# Altium schematic sheet Main.SchDoc
size A2
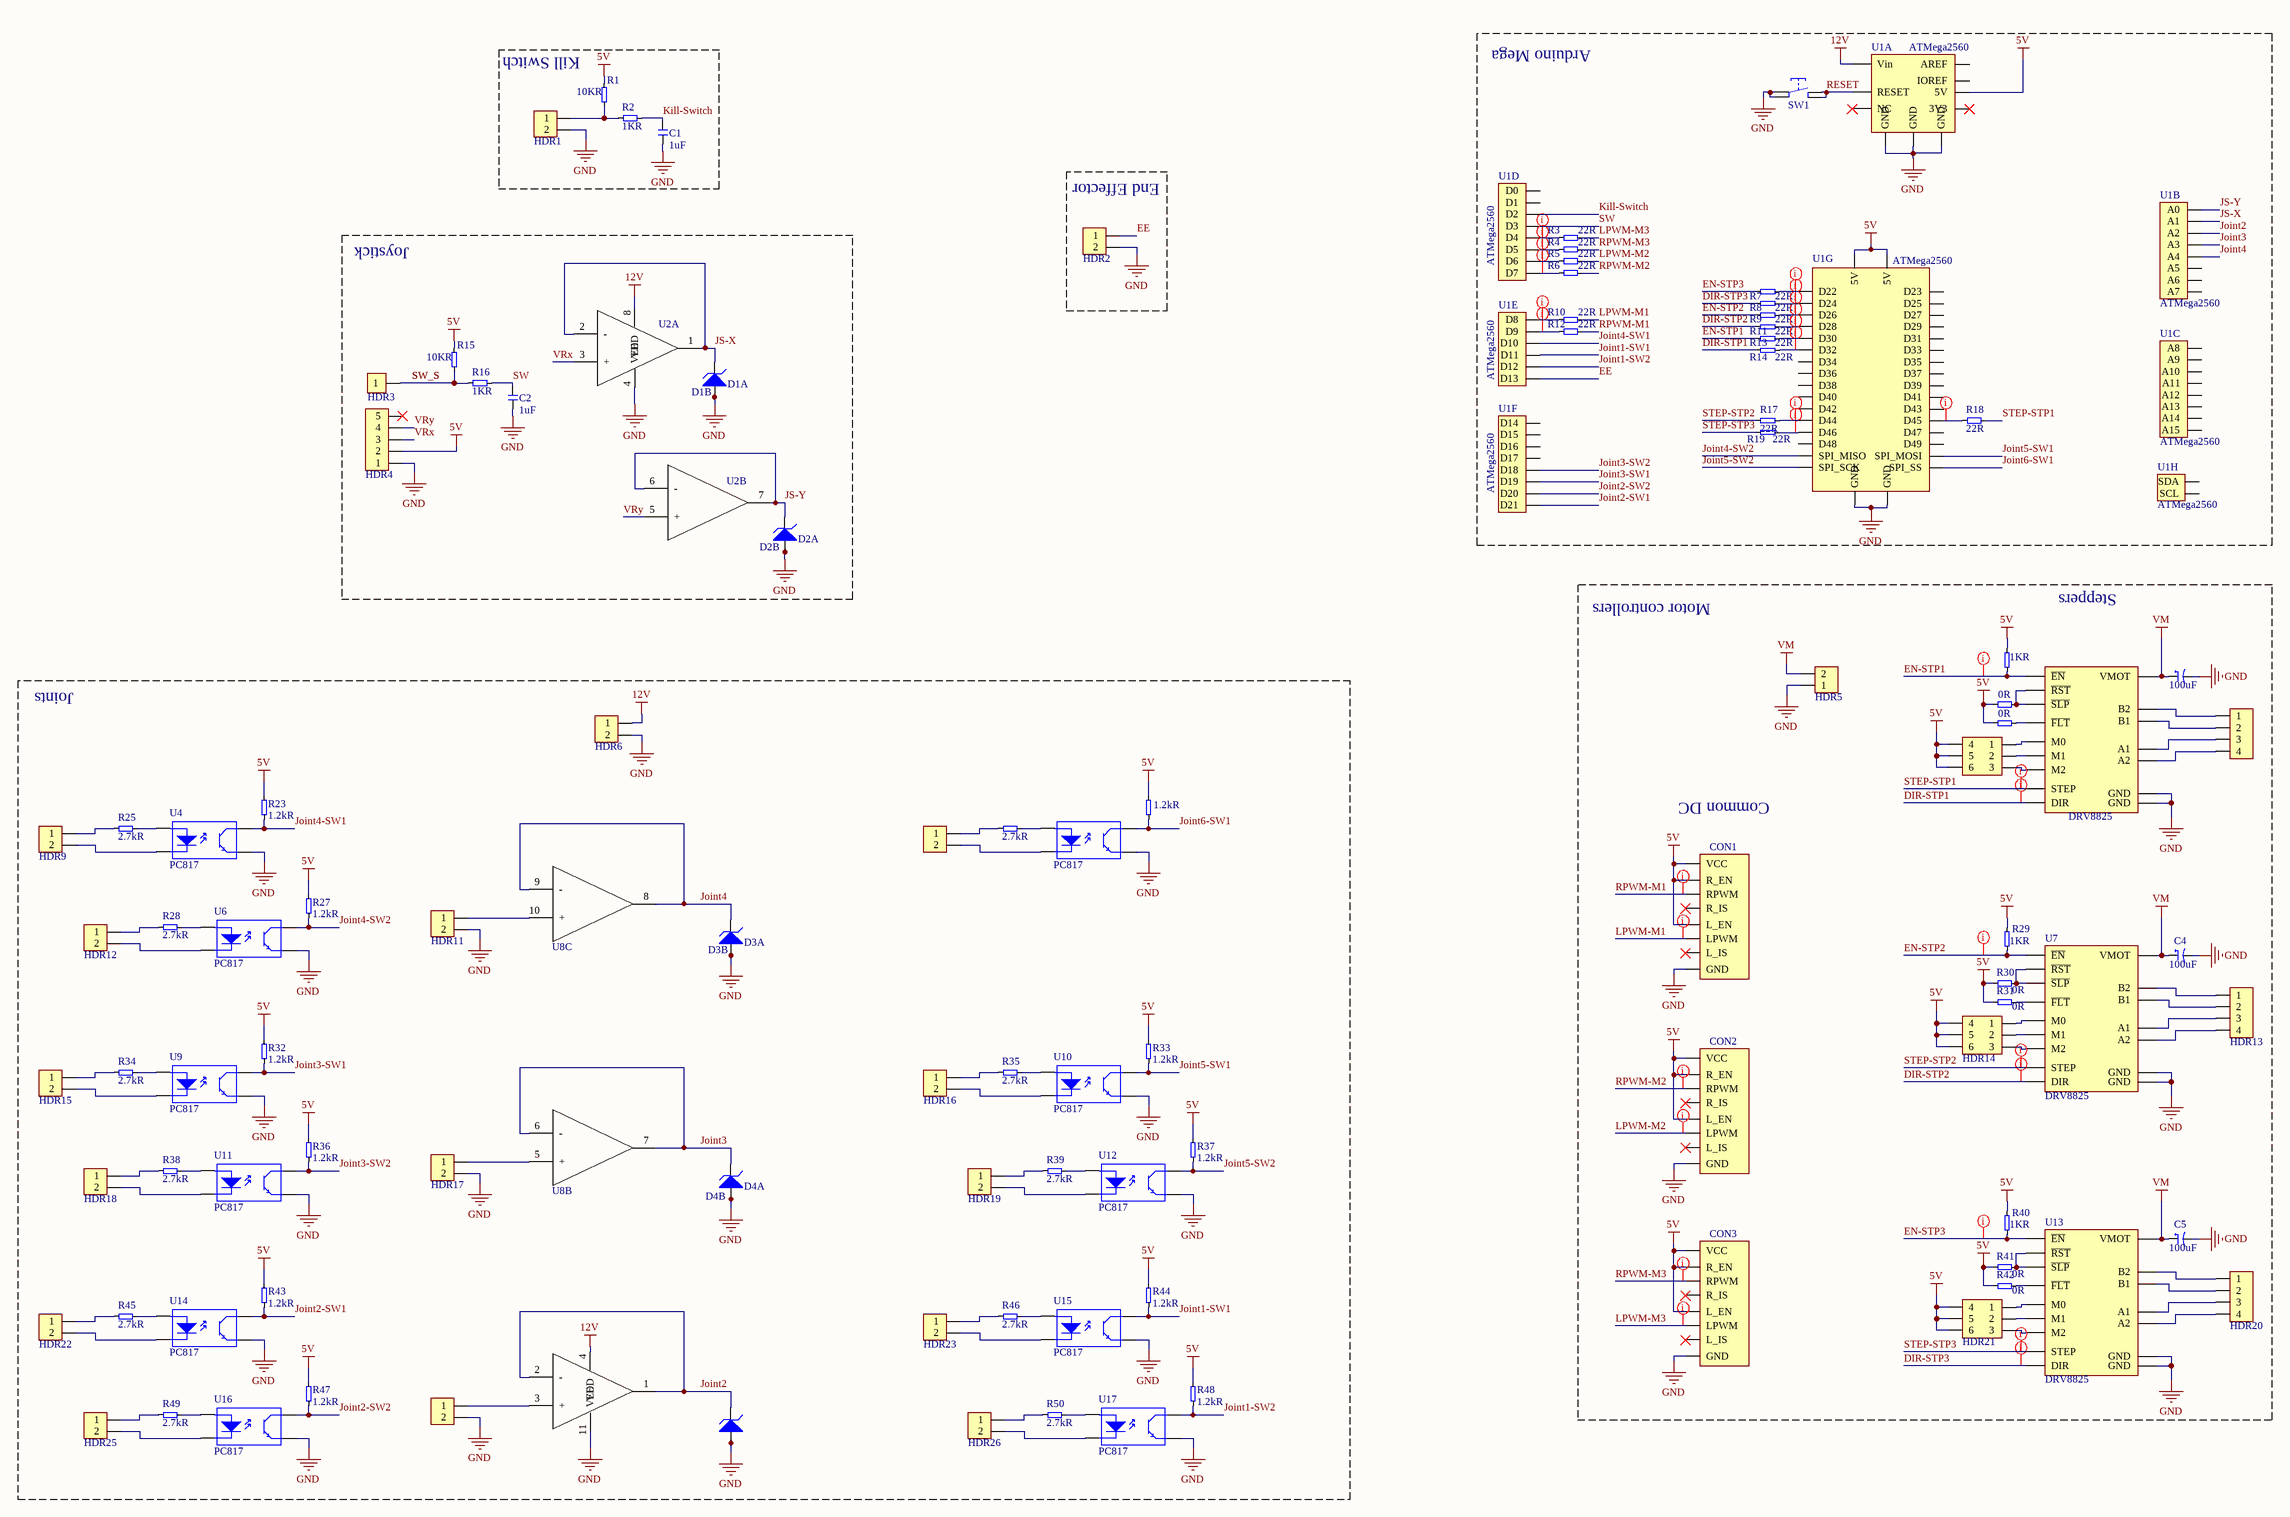
[diagram p0: Main.SchDoc]

## Parts
C1  1uF  [0603]
C2  1uF  [0603]
C3  100uF  [C-AL-SMD-C]
C4  100uF  [C-AL-SMD-C]
C5  100uF  [C-AL-SMD-C]
CON1  BTS7960-Coonector  [HEADER-2x4]  (value not drawn)
CON2  BTS7960-Coonector  [HEADER-2x4]  (value not drawn)
CON3  BTS7960-Coonector  [HEADER-2x4]  (value not drawn)
D1  D. Zener - SOT23-3 2NC  [SOT-23-3]  (value not drawn)  (parts A,B of 2)
D2  D. Zener - SOT23-3 2NC  [SOT-23-3]  (value not drawn)  (parts A,B of 2)
D3  D. Zener - SOT23-3 2NC  [SOT-23-3]  (value not drawn)  (parts A,B of 2)
D4  D. Zener - SOT23-3 2NC  [SOT-23-3]  (value not drawn)  (parts A,B of 2)
D5  D. Zener - SOT23-3 2NC  [SOT-23-3]  (value not drawn)  (parts A,B of 2)
HDR1  Header 1x2  [HEADER-1X2-KK]  (value not drawn)
HDR2  Header 1x2  [HEADER-1X2-KK]  (value not drawn)
HDR3  Header 1x1  [HEADER-1x1]  (value not drawn)
HDR4  Header 1x5  [HEADER-1X5]  (value not drawn)
HDR5  Header 1x2  [HEADER-1X2-BORNE-25-E1000]  (value not drawn)
HDR6  Header 1x2  [HEADER-1X2-KK]  (value not drawn)
HDR7  Header 1x4  [Header-1x4-KK]  (value not drawn)
HDR8  Header 2x3  [Header-2x3-Male]  (value not drawn)
HDR9  Header 1x2  [HEADER-1X2-KK]  (value not drawn)
HDR10  Header 1x2  [HEADER-1X2-KK]  (value not drawn)
HDR11  Header 1x2  [HEADER-1X2-KK]  (value not drawn)
HDR12  Header 1x2  [HEADER-1X2-KK]  (value not drawn)
HDR13  Header 1x4  [Header-1x4-KK]  (value not drawn)
HDR14  Header 2x3  [Header-2x3-Male]  (value not drawn)
HDR15  Header 1x2  [HEADER-1X2-KK]  (value not drawn)
HDR16  Header 1x2  [HEADER-1X2-KK]  (value not drawn)
HDR17  Header 1x2  [HEADER-1X2-KK]  (value not drawn)
HDR18  Header 1x2  [HEADER-1X2-KK]  (value not drawn)
HDR19  Header 1x2  [HEADER-1X2-KK]  (value not drawn)
HDR20  Header 1x4  [Header-1x4-KK]  (value not drawn)
HDR21  Header 2x3  [Header-2x3-Male]  (value not drawn)
HDR22  Header 1x2  [HEADER-1X2-KK]  (value not drawn)
HDR23  Header 1x2  [HEADER-1X2-KK]  (value not drawn)
HDR24  Header 1x2  [HEADER-1X2-KK]  (value not drawn)
HDR25  Header 1x2  [HEADER-1X2-KK]  (value not drawn)
HDR26  Header 1x2  [HEADER-1X2-KK]  (value not drawn)
R1  10KR  [0603]
R2  1KR  [0603]
R3  22R  [0603]
R4  22R  [0603]
R5  22R  [0603]
R6  22R  [0603]
R7  22R  [0603]
R8  22R  [0603]
R9  22R  [0603]
R10  22R  [0603]
R11  22R  [0603]
R12  22R  [0603]
R13  22R  [0603]
R14  22R  [0603]
R15  10KR  [0603]
R16  1KR  [0603]
R17  22R  [0603]
R18  22R  [0603]
R19  22R  [0603]
R20  1KR  [0603]
R21  0R  [0603]
R22  0R  [0603]
R23  1.2kR  [0603]
R24  1.2kR  [0603]
R25  2.7kR  [0603]
R26  2.7kR  [0603]
R27  1.2kR  [0603]
R28  2.7kR  [0603]
R29  1KR  [0603]
R30  0R  [0603]
R31  0R  [0603]
R32  1.2kR  [0603]
R33  1.2kR  [0603]
R34  2.7kR  [0603]
R35  2.7kR  [0603]
R36  1.2kR  [0603]
R37  1.2kR  [0603]
R38  2.7kR  [0603]
R39  2.7kR  [0603]
R40  1KR  [0603]
R41  0R  [0603]
R42  0R  [0603]
R43  1.2kR  [0603]
R44  1.2kR  [0603]
R45  2.7kR  [0603]
R46  2.7kR  [0603]
R47  1.2kR  [0603]
R48  1.2kR  [0603]
R49  2.7kR  [0603]
R50  2.7kR  [0603]
SW1  Button  [TL 3342]  (value not drawn)
U1  ATMega2560  [Arduino-Mega2560]  (parts A,B,C,D,E,F,G,H of 8)
U2  AmpOp-2u  [SOIC-8]  (value not drawn)  (parts A,B of 2)
U3  DRV8825  [DRV8825]
U4  PC817  [SOP-04]
U5  PC817  [SOP-04]
U6  PC817  [SOP-04]
U7  DRV8825  [DRV8825]
U8  AmpOp-4u  [SOIC-14]  (value not drawn)  (parts A,B,C of 4)
U9  PC817  [SOP-04]
U10  PC817  [SOP-04]
U11  PC817  [SOP-04]
U12  PC817  [SOP-04]
U13  DRV8825  [DRV8825]
U14  PC817  [SOP-04]
U15  PC817  [SOP-04]
U16  PC817  [SOP-04]
U17  PC817  [SOP-04]

## Blocks framed on the sheet
Arduino Mega: R3-R14 R17-R19 SW1 U1
Kill Switch: C1 HDR1 R1 R2
End Effector: HDR2
Joystick: C2 D1 D2 HDR3 HDR4 R15 R16 U2
Joints: D3-D5 HDR6 HDR9-HDR12 HDR15-HDR19 HDR22-HDR26 R23-R28 R32-R39 R43-R50 U4-U6 U8-U12 U14-U17

## Nets
5V: CON1.3(R_EN) CON1.4(L_EN) CON1.7(VCC) CON2.3(R_EN) CON2.4(L_EN) CON2.7(VCC) CON3.3(R_EN) CON3.4(L_EN) CON3.7(VCC) HDR4.2 HDR8.4 HDR8.5 HDR8.6 HDR14.4 HDR14.5 HDR14.6 HDR21.4 HDR21.5 HDR21.6 R1.2 R15.2 R20.2 R21.2 R22.2 R23.2 R24.2 R27.2 R29.2 R30.2 R31.2 R32.2 R33.2 R36.2 R37.2 R40.2 R41.2 R42.2 R43.2 R44.2 R47.2 R48.2 U1.5(5V) U1.59(5V) U1.60(5V)
12V: HDR6.1 U1.8(Vin) U2.8(VDD) U8.4(VDD)
GND: C1.2 C2.2 C3.2 C4.2 C5.2 CON1.8(GND) CON2.8(GND) CON3.8(GND) D1.1 D1.2 D2.1 D2.2 D3.1 D3.2 D4.1 D4.2 D5.1 D5.2 HDR1.2 HDR2.2 HDR4.1 HDR5.1 HDR6.2 HDR11.2 HDR17.2 HDR24.2 SW1.3 SW1.4 U1.6(GND) U1.7(GND) U1.25(GND) U1.26(GND) U1.83(GND) U2.4(VEE) U3.10(GND) U3.16(GND) U4.3 U5.3 U6.3 U7.10(GND) U7.16(GND) U8.11(VEE) U9.3 U10.3 U11.3 U12.3 U13.10(GND) U13.16(GND) U14.3 U15.3 U16.3 U17.3
VM: C3.1 C4.1 C5.1 HDR5.2 U3.9(VMOT) U7.9(VMOT) U13.9(VMOT)
DIR-STP1: R14.2 U3.8(DIR)
DIR-STP2: R11.2 U7.8(DIR)
DIR-STP3: R8.2 U13.8(DIR)
EE: HDR2.1 U1.82(D13)
EN-STP1: R13.2 R20.1 U3.1(~{EN})
EN-STP2: R9.2 R29.1 U7.1(~{EN})
EN-STP3: R7.2 R40.1 U13.1(~{EN})
Joint1-SW1: R44.1 U1.80(D11) U15.4
Joint1-SW2: R48.1 U1.81(D12) U17.4
Joint2: D5.3 U1.11(A2) U8.1(NC) U8.2(-)
Joint2-SW1: R43.1 U1.61(D21) U14.4
Joint2-SW2: R47.1 U1.62(D20) U16.4
Joint3: D4.3 U1.12(A3) U8.6(-) U8.7(VDD)
Joint3-SW1: R32.1 U1.63(D19) U9.4
Joint3-SW2: R36.1 U1.64(D18) U11.4
Joint4: D3.3 U1.13(A4) U8.8(VDD) U8.9(-)
Joint4-SW1: R23.1 U1.79(D10) U4.4
Joint4-SW2: R27.1 U1.30(SPI_MISO) U6.4
Joint5-SW1: R33.1 U1.29(SPI_MOSI) U10.4
Joint5-SW2: R37.1 U1.28(SPI_SCK) U12.4
Joint6-SW1: R24.1 U1.27(SPI_SS) U5.4
JS-X: D1.3 U1.10(A1) U2.1(NC) U2.2(-)
JS-Y: D2.3 U1.9(A0) U2.6(-) U2.7(VDD)
Kill-Switch: C1.1 R2.2 U1.71(D2)
LPWM-M1: CON1.2(LPWM) R10.2
LPWM-M2: CON2.2(LPWM) R5.2
LPWM-M3: CON3.2(LPWM) R3.2
RESET: SW1.1 SW1.2 U1.3(RESET)
RPWM-M1: CON1.1(RPWM) R12.2
RPWM-M2: CON2.1(RPWM) R6.2
RPWM-M3: CON3.1(RPWM) R4.2
STEP-STP1: R18.2 U3.7(STEP)
STEP-STP2: R17.2 U7.7(STEP)
STEP-STP3: R19.2 U13.7(STEP)
SW: C2.1 R16.2 U1.72(D3)
SW_S: HDR3.1 R15.1 R16.1
VRx: HDR4.3 U2.3(+)
VRy: HDR4.4 U2.5(+)
NetHDR1_1: HDR1.1 R1.1 R2.1
NetHDR7_1: HDR7.1 U3.11(B2)
NetHDR7_2: HDR7.2 U3.12(B1)
NetHDR7_3: HDR7.3 U3.13(A1)
NetHDR7_4: HDR7.4 U3.14(A2)
NetHDR8_1: HDR8.1 U3.2(M0)
NetHDR8_2: HDR8.2 U3.3(M1)
NetHDR8_3: HDR8.3 U3.4(M2)
NetHDR9_1: HDR9.1 R25.1
NetHDR9_2: HDR9.2 U4.2
NetHDR10_1: HDR10.1 R26.1
NetHDR10_2: HDR10.2 U5.2
NetHDR11_1: HDR11.1 U8.10(+)
NetHDR12_1: HDR12.1 R28.1
NetHDR12_2: HDR12.2 U6.2
NetHDR13_1: HDR13.1 U7.11(B2)
NetHDR13_2: HDR13.2 U7.12(B1)
NetHDR13_3: HDR13.3 U7.13(A1)
NetHDR13_4: HDR13.4 U7.14(A2)
NetHDR14_1: HDR14.1 U7.2(M0)
NetHDR14_2: HDR14.2 U7.3(M1)
NetHDR14_3: HDR14.3 U7.4(M2)
NetHDR15_1: HDR15.1 R34.1
NetHDR15_2: HDR15.2 U9.2
NetHDR16_1: HDR16.1 R35.1
NetHDR16_2: HDR16.2 U10.2
NetHDR17_1: HDR17.1 U8.5(+)
NetHDR18_1: HDR18.1 R38.1
NetHDR18_2: HDR18.2 U11.2
NetHDR19_1: HDR19.1 R39.1
NetHDR19_2: HDR19.2 U12.2
NetHDR20_1: HDR20.1 U13.11(B2)
NetHDR20_2: HDR20.2 U13.12(B1)
NetHDR20_3: HDR20.3 U13.13(A1)
NetHDR20_4: HDR20.4 U13.14(A2)
NetHDR21_1: HDR21.1 U13.2(M0)
NetHDR21_2: HDR21.2 U13.3(M1)
NetHDR21_3: HDR21.3 U13.4(M2)
NetHDR22_1: HDR22.1 R45.1
NetHDR22_2: HDR22.2 U14.2
NetHDR23_1: HDR23.1 R46.1
NetHDR23_2: HDR23.2 U15.2
NetHDR24_1: HDR24.1 U8.3(+)
NetHDR25_1: HDR25.1 R49.1
NetHDR25_2: HDR25.2 U16.2
NetHDR26_1: HDR26.1 R50.1
NetHDR26_2: HDR26.2 U17.2
NetR3_1: R3.1 U1.73(D4)
NetR4_1: R4.1 U1.74(D5)
NetR5_1: R5.1 U1.75(D6)
NetR6_1: R6.1 U1.76(D7)
NetR7_1: R7.1 U1.58(D22)
NetR8_1: R8.1 U1.56(D24)
NetR9_1: R9.1 U1.54(D26)
NetR10_1: R10.1 U1.77(D8)
NetR11_1: R11.1 U1.52(D28)
NetR12_1: R12.1 U1.78(D9)
NetR13_1: R13.1 U1.50(D30)
NetR14_1: R14.1 U1.48(D32)
NetR17_1: R17.1 U1.36(D44)
NetR18_1: R18.1 U1.35(D45)
NetR19_1: R19.1 U1.34(D46)
NetR21_1: R21.1 U3.5(~{RST}) U3.6(~{SLP})
NetR22_1: R22.1 U3.15(~{FLT})
NetR25_2: R25.2 U4.1
NetR26_2: R26.2 U5.1
NetR28_2: R28.2 U6.1
NetR30_1: R30.1 U7.5(~{RST}) U7.6(~{SLP})
NetR31_1: R31.1 U7.15(~{FLT})
NetR34_2: R34.2 U9.1
NetR35_2: R35.2 U10.1
NetR38_2: R38.2 U11.1
NetR39_2: R39.2 U12.1
NetR41_1: R41.1 U13.5(~{RST}) U13.6(~{SLP})
NetR42_1: R42.1 U13.15(~{FLT})
NetR45_2: R45.2 U14.1
NetR46_2: R46.2 U15.1
NetR49_2: R49.2 U16.1
NetR50_2: R50.2 U17.1

Not connected (* = marked no-connect by the designer): CON1 5(R_IS)* 6(L_IS)*; CON2 5(R_IS)* 6(L_IS)*; CON3 5(R_IS)* 6(L_IS)*; HDR4 5*; U1 1(NC)* 2(IOREF) 4(3V3)* 14(A5) 15(A6) 16(A7) 17(A8) 18(A9) 19(A10) 20(A11) 21(A12) 22(A13) 23(A14) 24(A15) 31(D49) 32(D48) 33(D47) 37(D43) 38(D42) 39(D41) 40(D40) 41(D39) 42(D38) 43(D37) 44(D36) 45(D35) 46(D34) 47(D33) 49(D31) 51(D29) 53(D27) 55(D25) 57(D23) 65(D17) 66(D16) 67(D15) 68(D14) 69(D0) 70(D1) 84(AREF) 85(SDA) 86(SCL)

## Layout directives
rule Impedance Constraint [Min = 40.00    Max = 50.00    ]: DIR-STP1, DIR-STP2, DIR-STP3, EN-STP1, EN-STP2, EN-STP3, LPWM-M1, LPWM-M2, LPWM-M3, RPWM-M1, RPWM-M2, RPWM-M3, STEP-STP1, STEP-STP2, STEP-STP3
rule Impedance Constraint [Min = 0.000    Max = 2.000    ]: NetR3_1, NetR4_1, NetR5_1, NetR6_1, NetR7_1, NetR8_1, NetR9_1, NetR10_1, NetR11_1, NetR12_1, NetR13_1, NetR14_1, NetR17_1, NetR18_1, NetR19_1

## Notes on the sheet
- Motor controllers
- Steppers
- (near CON1) Common DC
- Title
- Size:
- Date:
- File:
- A2
- Number:
- Time:
- Revision:
- Sheet
- of

## Library data of the parts
C1 C2 = Capacitor-1: Capacitor; Rating: xV; Tolerance: x%; Value: 1uF
C3-C5 = Capacitor-2: Capacitor; Rating: xV; Tolerance: x%; Value: 100uF
CON1-CON3 = BTS7960: Connector for BTS7960 DC-Motor H Bridge
D1-D5 = D. Zener - SOT23-3 2NC: Zener Diode SOT23 - 2NC; Part: BZX84C
HDR4 = Header 1x5: Header 1x4
HDR8 HDR14 HDR21 = Header 2x3: pin to pad: 1>3 3>1
R1-R50 = Resistor-1: Resistor; Tolerance: 10%
  R1 R15: Value: 10KR
  R2 R16 R20 R29 R40: Value: 1KR
  R3-R14 R17-R19: Value: 22R
  R21 R22 R30 R31 R41 R42: Value: 0R
  R23 R24 R27 R32 R33 R36 R37 R43 R44 R47 R48: Value: 1.2kR
  R25 R26 R28 R34 R35 R38 R39 R45 R46 R49 R50: Value: 2.7kR
SW1 = Button: Common Push-Button
U1 = Arduino Mega - ATMega2560: Arduino Mega shield-like controller
U2 = AmpOp-2u: AmpOp Single Supply IC Rail-to-Rail with 2 units; Part n: MCP602
U3 U7 U13 = DRV8825: DRV8825 Driver for Stepper Motors
U4-U6 U9-U12 U14-U17 = Optocoupler
U8 = AmpOp-4u: AmpOp Single Supply IC Rail-to-Rail with 4 units; Part n: LM324